# EAGLE design Sensor_Cameralink_TRX (EAGLE 9.6.2)
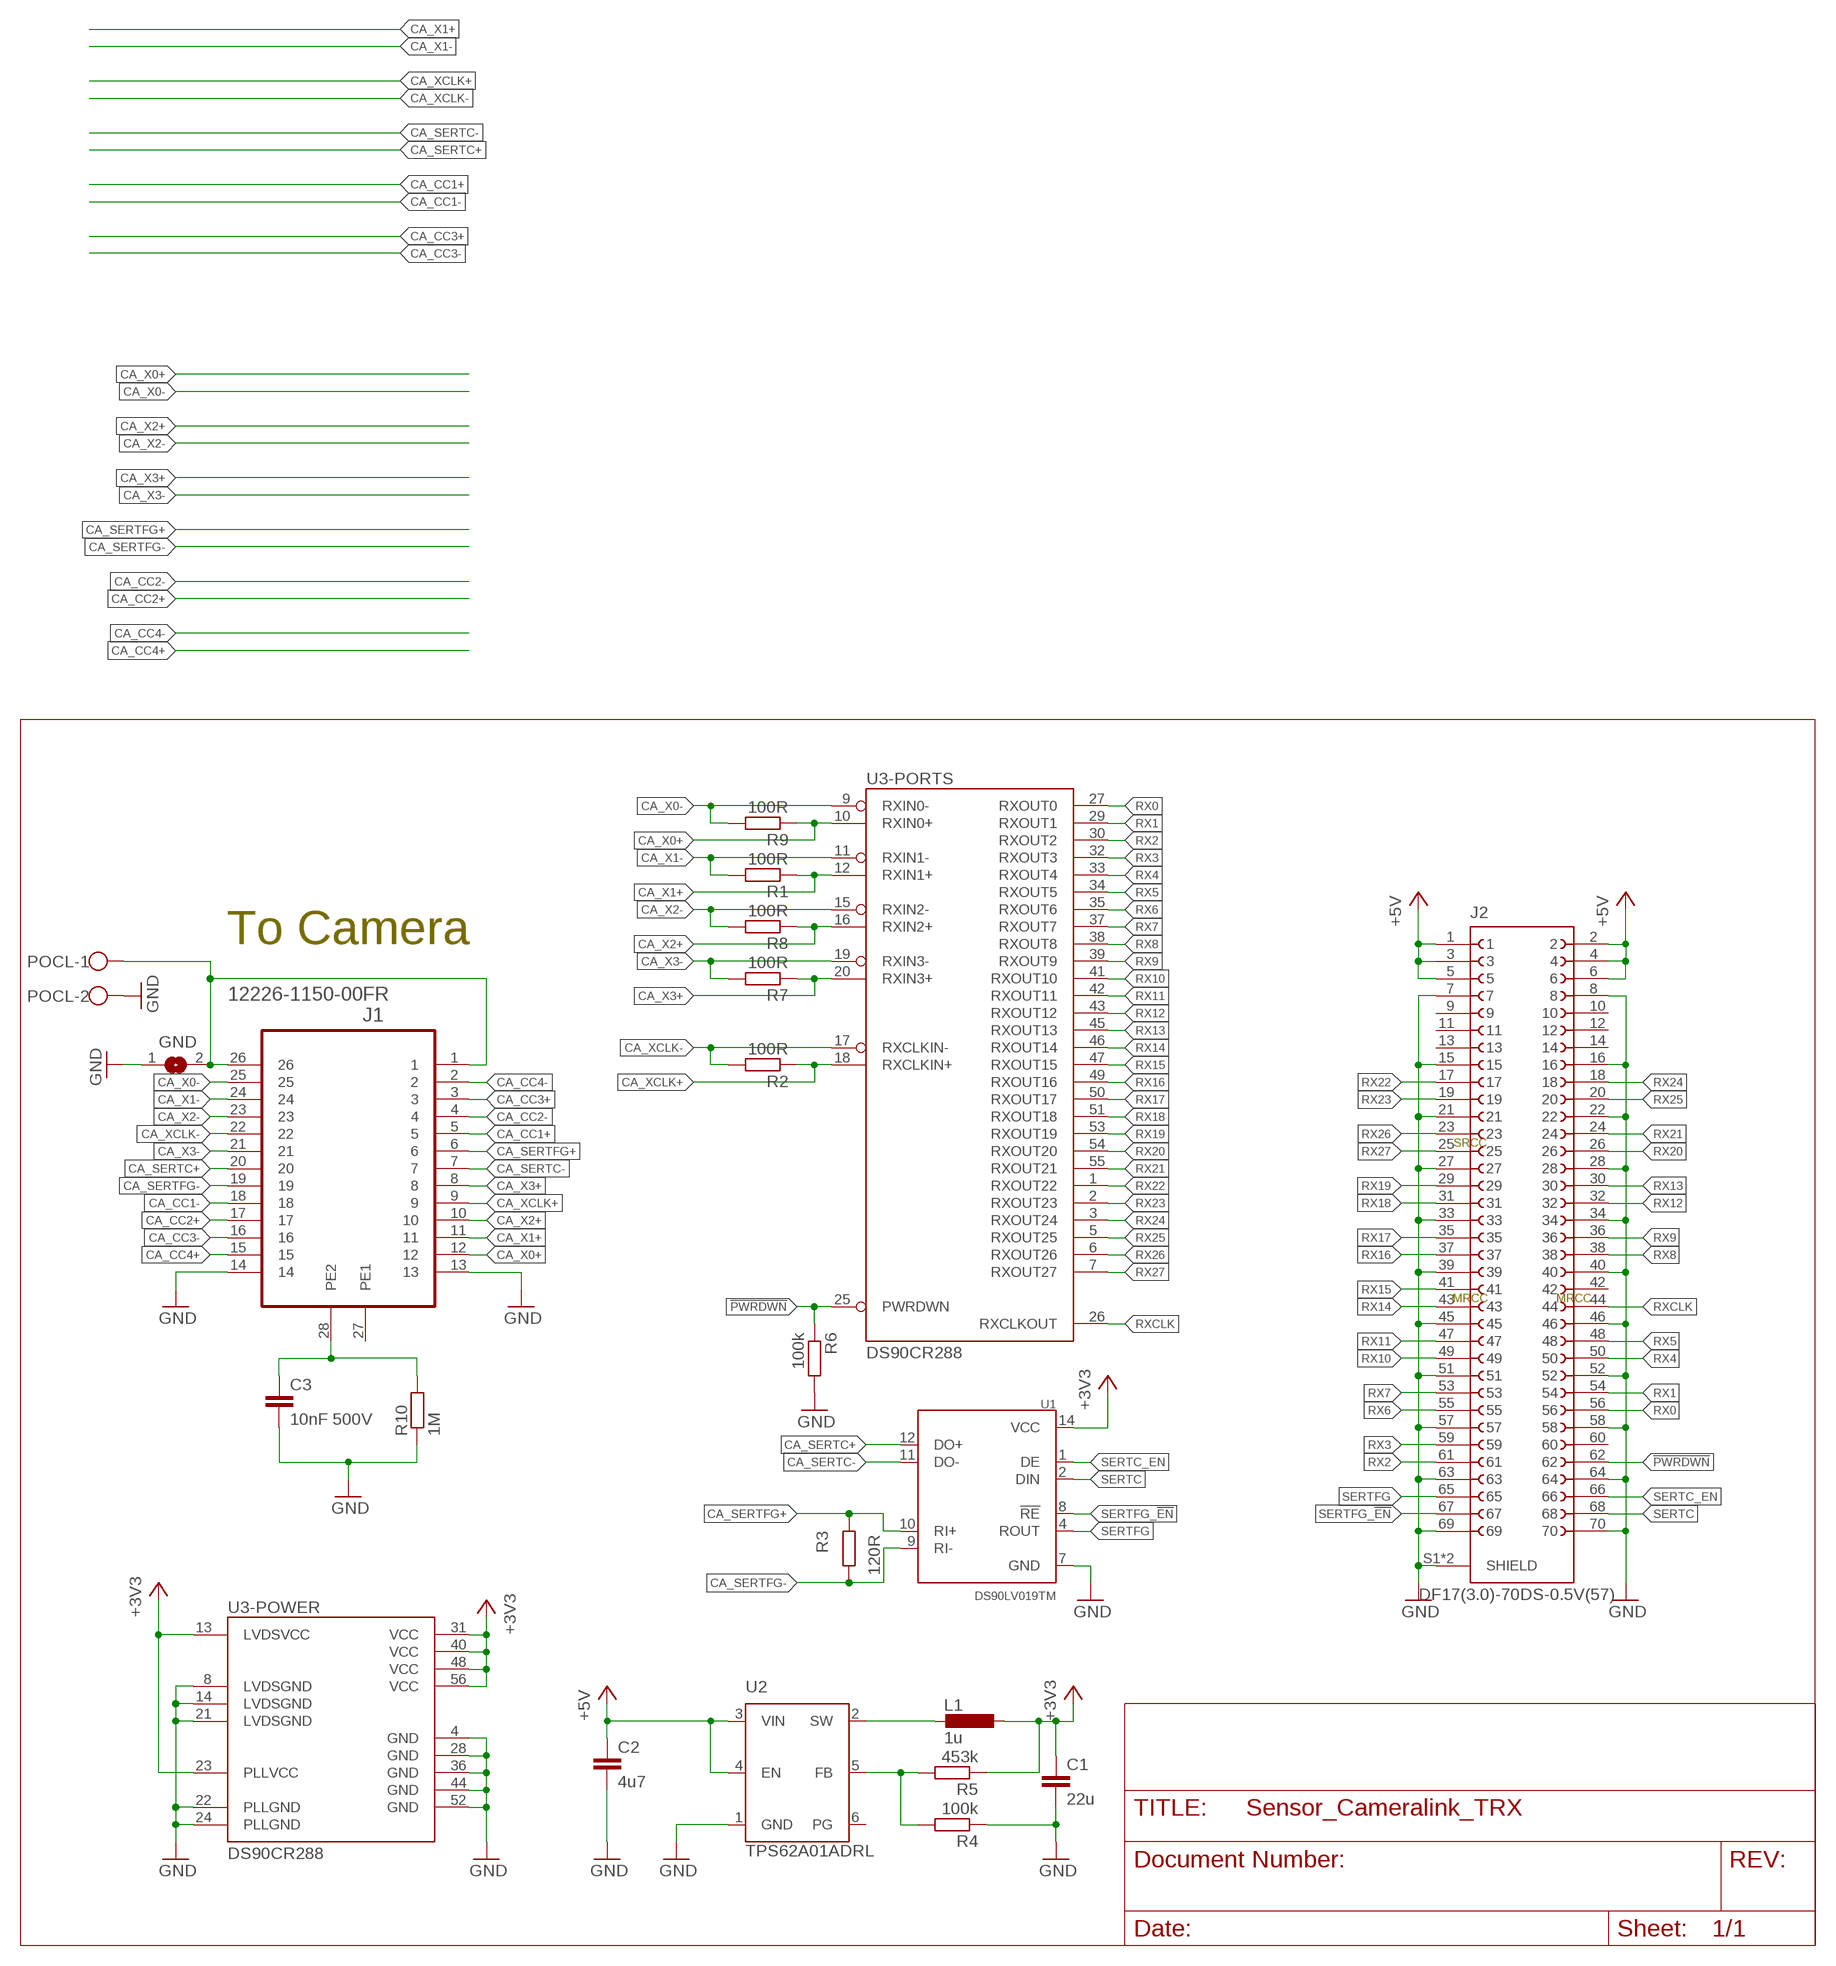
[diagram p0: schematic, sheet 1]

## Parts
C1  22u  C-EUC0603  [C0603]
C2  4u7  C-EUC0603  [C0603]
C3  10nF 500V  C-EUC0805  [C0805]
GND  SJ  [SJ]
J1  12226-1150-00FR  [3M_12226-1150-00FR]
J2  DF17(3.0)-70DS-0.5V(57)  [DF17(3.0)-70DS-0.5V(57)]
L1  1u  L-EU1008  [L1008]
POCL  W237-102  [W237-102]
R1  100R  R-EU_R0402  [R0402]
R2  100R  R-EU_R0402  [R0402]
R3  120R  R-EU_R0402  [R0402]
R4  100k  R-EU_R0402  [R0402]
R5  453k  R-EU_R0402  [R0402]
R6  100k  R-EU_R0402  [R0402]
R7  100R  R-EU_R0402  [R0402]
R8  100R  R-EU_R0402  [R0402]
R9  100R  R-EU_R0402  [R0402]
R10  1M  R-EU_R0805  [R0805]
U1  DS90LV019TM  [SO-14]
U2  TPS62A01ADRL  [SOTFL50P160X60-6N]
U3  DS90CR288  [HTSSOP56]

## Nets
!PWRDWN: J2.62 R6.1 U3.25(-PORTS:PWRDWN)
+3V3: C1.1 L1.1 R5.1 U1.14(VCC) U3.13(-POWER:LVDSVCC) U3.23(-POWER:PLLVCC) U3.31(-POWER:VCC) U3.40(-POWER:VCC) U3.48(-POWER:VCC) U3.56(-POWER:VCC)
+5V: C2.1 J2.1 J2.2 J2.3 J2.4 J2.5 J2.6 U2.3(VIN) U2.4(EN)
CA_CC1+: J1.5
CA_CC1-: J1.18
CA_CC2+: J1.17
CA_CC2-: J1.4
CA_CC3+: J1.3
CA_CC3-: J1.16
CA_CC4+: J1.15
CA_CC4-: J1.2
CA_SERTC+: J1.20 U1.12(DO+)
CA_SERTC-: J1.7 U1.11(DO-)
CA_SERTFG+: J1.6 R3.1 U1.10(RI+)
CA_SERTFG-: J1.19 R3.2 U1.9(RI-)
CA_X0+: J1.12 R9.1 U3.10(-PORTS:RXIN0+)
CA_X0-: J1.25 R9.2 U3.9(-PORTS:RXIN0-)
CA_X1+: J1.11 R1.1 U3.12(-PORTS:RXIN1+)
CA_X1-: J1.24 R1.2 U3.11(-PORTS:RXIN1-)
CA_X2+: J1.10 R8.1 U3.16(-PORTS:RXIN2+)
CA_X2-: J1.23 R8.2 U3.15(-PORTS:RXIN2-)
CA_X3+: J1.8 R7.1 U3.20(-PORTS:RXIN3+)
CA_X3-: J1.21 R7.2 U3.19(-PORTS:RXIN3-)
CA_XCLK+: J1.9 R2.1 U3.18(-PORTS:RXCLKIN+)
CA_XCLK-: J1.22 R2.2 U3.17(-PORTS:RXCLKIN-)
GND: C1.2 C2.2 C3.2 GND.1 J1.13 J1.14 J2.7 J2.8 J2.15 J2.16 J2.21 J2.22 J2.27 J2.28 J2.33 J2.34 J2.39 J2.40 J2.45 J2.46 J2.51 J2.52 J2.57 J2.58 J2.63 J2.64 J2.69 J2.70 J2.S1(SHIELD) J2.S2(SHIELD) POCL.2 R4.1 R6.2 R10.1 U1.7(GND) U2.1(GND) U3.4(-POWER:GND) U3.8(-POWER:LVDSGND) U3.14(-POWER:LVDSGND) U3.21(-POWER:LVDSGND) U3.22(-POWER:PLLGND) U3.24(-POWER:PLLGND) U3.28(-POWER:GND) U3.36(-POWER:GND) U3.44(-POWER:GND) U3.52(-POWER:GND)
N$00005: C3.1 J1.28(PE2) R10.2
N$00011: GND.2 J1.1 J1.26 POCL.1
N$00044: R4.2 R5.2 U2.5(FB)
N$50: L1.2 U2.2(SW)
RX0: J2.56 U3.27(-PORTS:RXOUT0)
RX1: J2.54 U3.29(-PORTS:RXOUT1)
RX2: J2.61 U3.30(-PORTS:RXOUT2)
RX3: J2.59 U3.32(-PORTS:RXOUT3)
RX4: J2.50 U3.33(-PORTS:RXOUT4)
RX5: J2.48 U3.34(-PORTS:RXOUT5)
RX6: J2.55 U3.35(-PORTS:RXOUT6)
RX7: J2.53 U3.37(-PORTS:RXOUT7)
RX8: J2.38 U3.38(-PORTS:RXOUT8)
RX9: J2.36 U3.39(-PORTS:RXOUT9)
RX10: J2.49 U3.41(-PORTS:RXOUT10)
RX11: J2.47 U3.42(-PORTS:RXOUT11)
RX12: J2.32 U3.43(-PORTS:RXOUT12)
RX13: J2.30 U3.45(-PORTS:RXOUT13)
RX14: J2.43 U3.46(-PORTS:RXOUT14)
RX15: J2.41 U3.47(-PORTS:RXOUT15)
RX16: J2.37 U3.49(-PORTS:RXOUT16)
RX17: J2.35 U3.50(-PORTS:RXOUT17)
RX18: J2.31 U3.51(-PORTS:RXOUT18)
RX19: J2.29 U3.53(-PORTS:RXOUT19)
RX20: J2.26 U3.54(-PORTS:RXOUT20)
RX21: J2.24 U3.55(-PORTS:RXOUT21)
RX22: J2.17 U3.1(-PORTS:RXOUT22)
RX23: J2.19 U3.2(-PORTS:RXOUT23)
RX24: J2.18 U3.3(-PORTS:RXOUT24)
RX25: J2.20 U3.5(-PORTS:RXOUT25)
RX26: J2.23 U3.6(-PORTS:RXOUT26)
RX27: J2.25 U3.7(-PORTS:RXOUT27)
RXCLK: J2.44 U3.26(-PORTS:RXCLKOUT)
SERTC: J2.68 U1.2(DIN)
SERTC_EN: J2.66 U1.1(DE)
SERTFG: J2.65 U1.4(ROUT)
SERTFG_!EN: J2.67 U1.8(!RE)
Unconnected: J1.27(PE1) J2.9 J2.10 J2.11 J2.12 J2.13 J2.14 J2.42 J2.60 U2.6(PG)

## Notes on the sheet
- To Camera
- SRCC
- MRCC | MRCC

## Library data of the parts
C1 = rcl:C-EU: CAPACITOR, European symbol; LCSC: C109448
C2 = rcl:C-EU: CAPACITOR, European symbol; LCSC: C19666
C3 = rcl:C-EU: CAPACITOR, European symbol; BUERKLIN: 56D510; LAGERORT: 67/01; MBM: 1; PREIS: 0,13
GND = jumper:SJ: SMD solder JUMPER
J1 = mh_fpga_anschlussplatine_v2:12226-1150-00FR: CONN SDR 26POS VERT RECEPT; FARNELL: 1321037; MBM: 1; PREIS: 10,08
J2 = Hirose:DF17(3.0)-70DS-0.5V(57)
L1 = rcl:L-EU: INDUCTOR, European symbol; DIGIKEY: 490-5112-1-ND; LCSC: C86091; MPN: LQM2HPN1R0MG0L
POCL = con-wago-500:W237-102: WAGO SCREW CLAMP; MPN: 237-102; OC_FARNELL: unknown; OC_NEWARK: 70K9898
R1 R2 R7-R9 = rcl:R-EU_: RESISTOR, European symbol; SPICEPREFIX: R
R3 = rcl:R-EU_: RESISTOR, European symbol; BUERKLIN: 07E508; MBM: 10; PREIS: 0,03; SPICEPREFIX: R
R4 R6 = rcl:R-EU_: RESISTOR, European symbol; DIGIKEY: RMCF0402FT100KCT-ND; LCSC: C60491; SPICEPREFIX: R
R5 = rcl:R-EU_: RESISTOR, European symbol; LCSC: C137978; SPICEPREFIX: R
R10 = resistor:R-EU_: RESISTOR, European symbol; BUERKLIN: 11E338; MBM: 10; PREIS: 0,04
U1 = texas:DS90LV019: DS90LV019 3.3V or 5V LVDS Driver/Receiver
U2 = TPS62A01DRLR:TPS62A01ADRL; DESCRIPTION: 2.5V-5.5V input, 1-A high efficiency step-down converter in 2x2 QFN or SOT563 package; DIGIKEY: 296-TPS62A01ADRLRCT-ND; HEIGHT: 0.6mm; LCSC: C5181455; MANUFACTURER_NAME: Texas Instruments; MANUFACTURER_PART_NUMBER: TPS62A01ADRLR; MOUSER: 595-TPS62A01ADRLR
U3 = lvds-2:DS90CR288

## Board
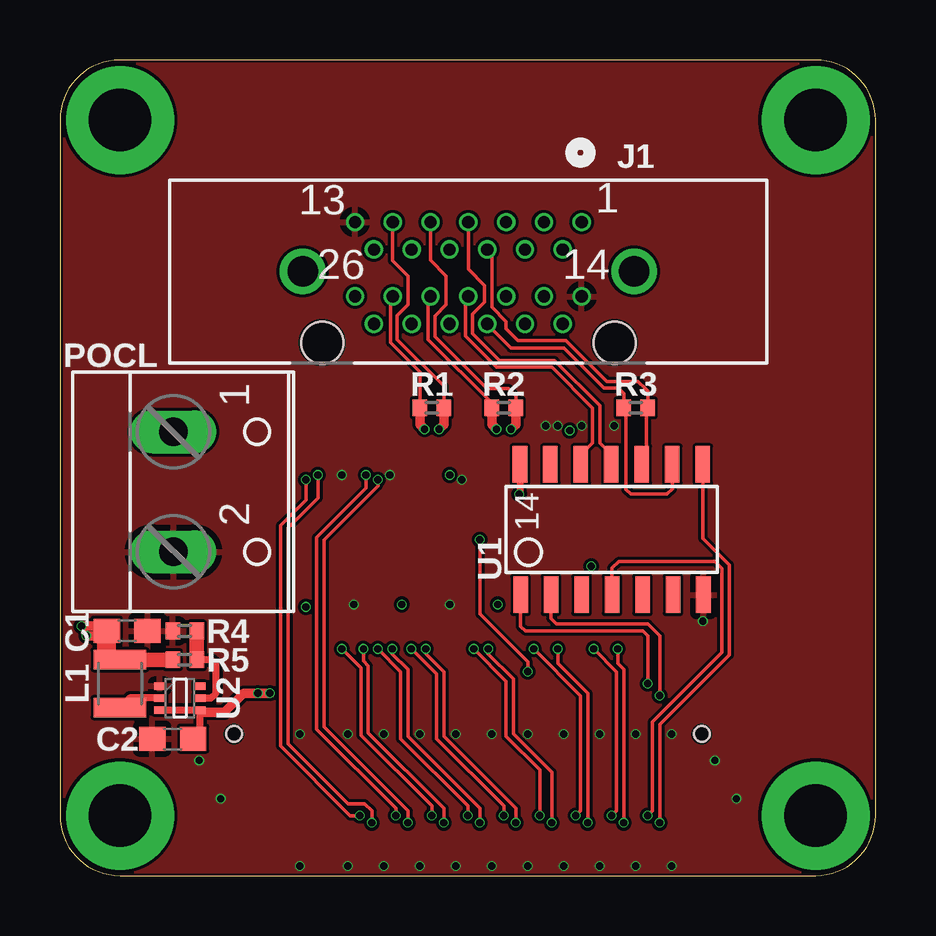
[diagram p1: board, top side]
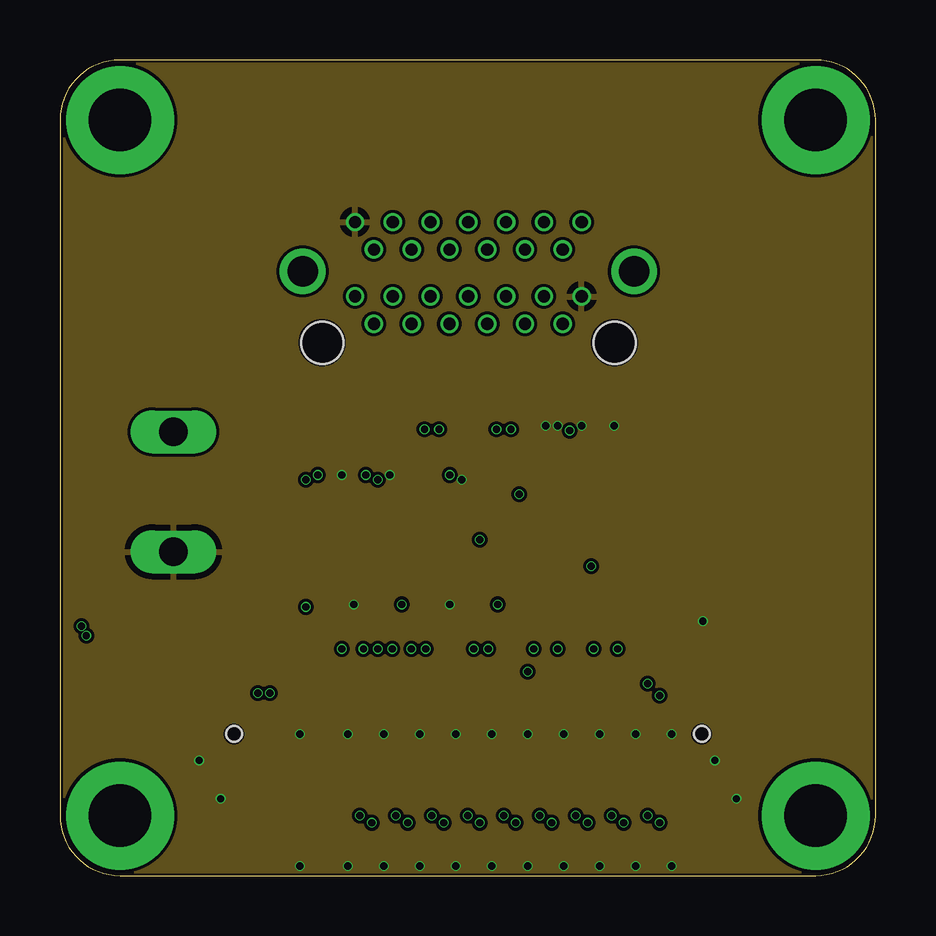
[diagram p2: board, inner layer Route2]
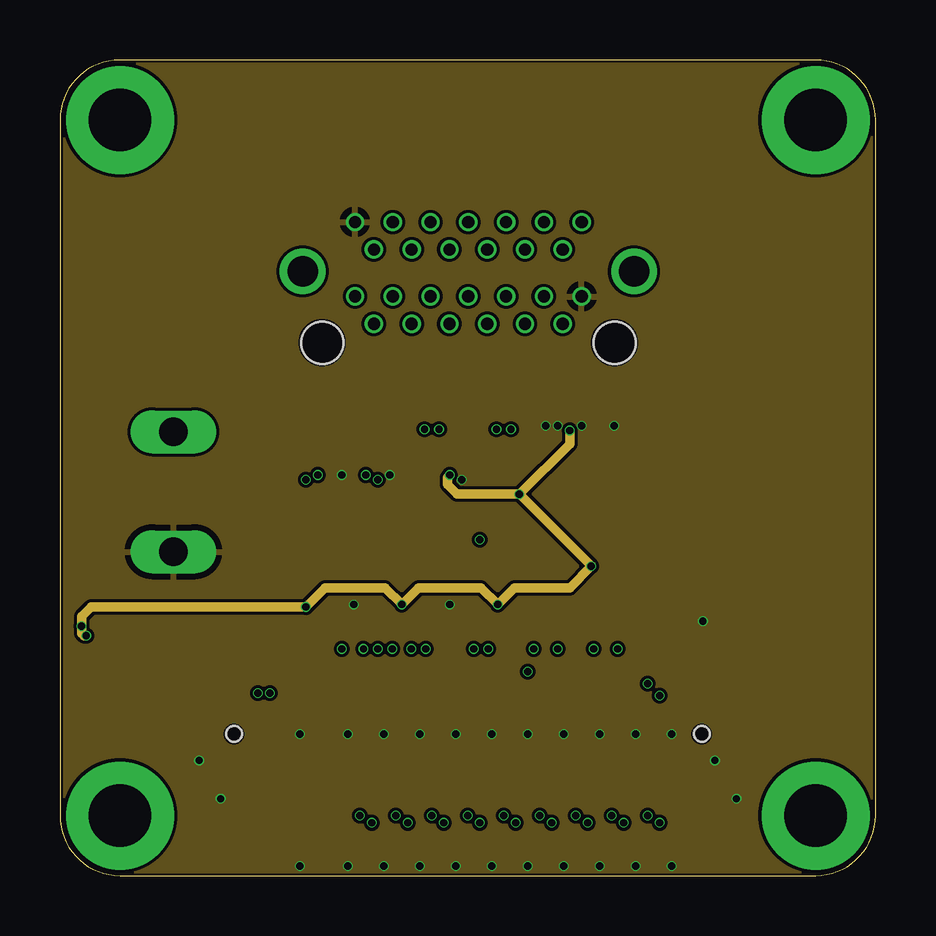
[diagram p3: board, inner layer Route15]
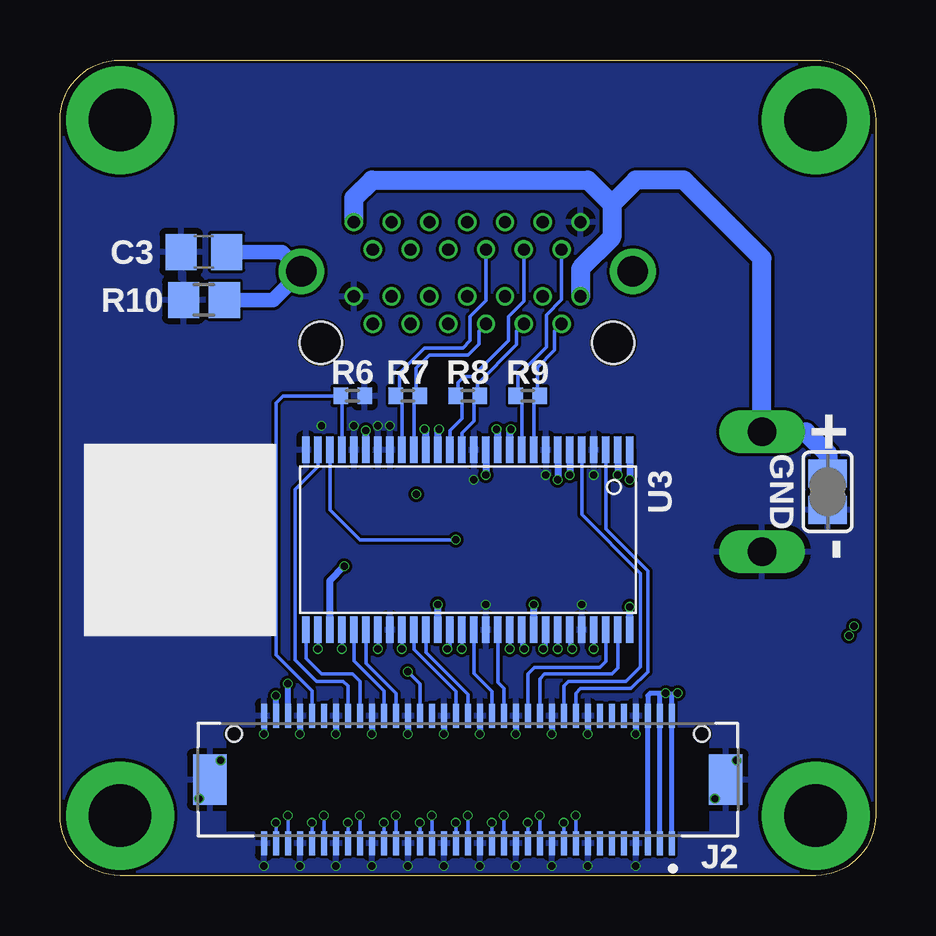
[diagram p4: board, bottom side, seen from below]

Size 34 x 34 mm. Coordinates in mm from the lower left corner, seen from the top.
Outline: 0,31.5 0,2.5 arc90 2.5,0 31.5,0 arc90 34,2.5 34,31.5 arc90 31.5,34 2.5,34 arc90 0,31.5
Copper layers (1*2*15*16): Top 0.035559375mm / dielectric 0.17018125mm / Route2 0.01778125mm / dielectric 47mil / Route15 0.01778125mm / dielectric 0.17018125mm / Bottom 0.035559375mm
Design rules "jlcpcb-4-layer *": minimum track width 5mil, minimum drill 0.2mm, track to track 5mil, track to pad 5mil, pad to pad 5mil, via to via 5mil, smd to smd 0mil, copper to edge 0.1mm, drill to drill 5mil, minimum pad ring 0.1mm, minimum via ring 0.05mm, stop-mask expansion 3mil, vias tented up to drill 100mil, thermal gap 10mil

### Footprints (pad centres in the part's own frame; a part is rotated, then mirrored left to right if it is on the bottom)
C0603 = smd 1.1 x 1: 1 -0.85,0; 2 0.85,0
C0805 = smd 1.3 x 1.5: 1 -0.95,0; 2 0.95,0
SJ = smd 1.168 x 1.6: 1 -0.762,0; 2 0.762,0
3M_12226-1150-00FR = drill 0.508: 1 9.449,4.242; 2 8.661,3.099; 3 7.874,4.242; 4 7.087,3.099; 5 6.299,4.242; 6 5.512,3.099; 7 4.724,4.242; 8 3.937,3.099; 9 3.15,4.242; 10 2.362,3.099; 11 1.575,4.242; 12 0.787,3.099; 13 0,4.242; 14 9.449,1.143; 15 8.661,0; 16 7.874,1.143; 17 7.087,0; 18 6.299,1.143; 19 5.512,0; 20 4.724,1.143; 21 3.937,0; 22 3.15,1.143; 23 2.362,0; 24 1.575,1.143; 25 0.787,0; 26 0,1.143 | drill 1.27: 27 -2.184,2.184; 28 11.633,2.184 | hole 1.753: -1.372,-0.787; 10.82,-0.787
DF17(3.0)-70DS-0.5V(57) = smd 0.25 x 1: 1 -8.5,2.65; 2 -8.5,-2.65; 3 -8,2.65; 4 -8,-2.65; 5 -7.5,2.65; 6 -7.5,-2.65; 7 -7,2.65; 8 -7,-2.65; 9 -6.5,2.65; 10 -6.5,-2.65; 11 -6,2.65; 12 -6,-2.65; 13 -5.5,2.65; 14 -5.5,-2.65; 15 -5,2.65; 16 -5,-2.65; 17 -4.5,2.65; 18 -4.5,-2.65; 19 -4,2.65; 20 -4,-2.65; 21 -3.5,2.65; 22 -3.5,-2.65; 23 -3,2.65; 24 -3,-2.65; 25 -2.5,2.65; 26 -2.5,-2.65; 27 -2,2.65; 28 -2,-2.65; 29 -1.5,2.65; 30 -1.5,-2.65; 31 -1,2.65; 32 -1,-2.65; 33 -0.5,2.65; 34 -0.5,-2.65; 35 0,2.65; 36 0,-2.65; 37 0.5,2.65; 38 0.5,-2.65; 39 1,2.65; 40 1,-2.65; 41 1.5,2.65; 42 1.5,-2.65; 43 2,2.65; 44 2,-2.65; 45 2.5,2.65; 46 2.5,-2.65; 47 3,2.65; 48 3,-2.65; 49 3.5,2.65; 50 3.5,-2.65; 51 4,2.65; 52 4,-2.65; 53 4.5,2.65; 54 4.5,-2.65; 55 5,2.65; 56 5,-2.65; 57 5.5,2.65; 58 5.5,-2.65; 59 6,2.65; 60 6,-2.65; 61 6.5,2.65; 62 6.5,-2.65; 63 7,2.65; 64 7,-2.65; 65 7.5,2.65; 66 7.5,-2.65; 67 8,2.65; 68 8,-2.65; 69 8.5,2.65; 70 8.5,-2.65 | smd 1.4 x 2.1: S1 -10.75,0; S2 10.75,0 | hole 0.65: -9.75,-1.9; 9.75,-1.9
L1008 = smd 0.8 x 2.2: 1 -1,0; 2 1,0
W237-102 = drill 1.194 long: 1 -2.5,-1.27; 2 2.5,-1.27
R0402 = smd 0.6 x 0.7: 1 -0.5,0; 2 0.5,0
R0805 = smd 1.3 x 1.5: 1 -0.85,0; 2 0.85,0
SO-14 = smd 0.61 x 1.524: 1 -3.795,-2.794; 2 -2.525,-2.794; 3 -1.255,-2.794; 4 0.015,-2.794; 5 1.285,-2.794; 6 2.555,-2.794; 7 3.825,-2.794; 8 3.795,2.644; 9 2.525,2.644; 10 1.255,2.644; 11 -0.015,2.644; 12 -1.285,2.644; 13 -2.555,2.644; 14 -3.825,2.644
SOTFL50P160X60-6N = smd 0.475 x 0.3: 1 -0.838,0.5; 2 -0.838,0; 3 -0.838,-0.5; 4 0.838,-0.5; 5 0.838,0; 6 0.838,0.5
HTSSOP56 = smd 0.3 x 1.1: 1 -6.75,-3.75; 2 -6.25,-3.75; 3 -5.75,-3.75; 4 -5.25,-3.75; 5 -4.75,-3.75; 6 -4.25,-3.75; 7 -3.75,-3.75; 8 -3.25,-3.75; 9 -2.75,-3.75; 10 -2.25,-3.75; 11 -1.75,-3.75; 12 -1.25,-3.75; 13 -0.75,-3.75; 14 -0.25,-3.75; 15 0.25,-3.75; 16 0.75,-3.75; 17 1.25,-3.75; 18 1.75,-3.75; 19 2.25,-3.75; 20 2.75,-3.75; 21 3.25,-3.75; 22 3.75,-3.75; 23 4.25,-3.75; 24 4.75,-3.75; 25 5.25,-3.75; 26 5.75,-3.75; 27 6.25,-3.75; 28 6.75,-3.75; 29 6.75,3.75; 30 6.25,3.75; 31 5.75,3.75; 32 5.25,3.75; 33 4.75,3.75; 34 4.25,3.75; 35 3.75,3.75; 36 3.25,3.75; 37 2.75,3.75; 38 2.25,3.75; 39 1.75,3.75; 40 1.25,3.75; 41 0.75,3.75; 42 0.25,3.75; 43 -0.25,3.75; 44 -0.75,3.75; 45 -1.25,3.75; 46 -1.75,3.75; 47 -2.25,3.75; 48 -2.75,3.75; 49 -3.25,3.75; 50 -3.75,3.75; 51 -4.25,3.75; 52 -4.75,3.75; 53 -5.25,3.75; 54 -5.75,3.75; 55 -6.25,3.75; 56 -6.75,3.75

### Placement (x,y rotation side)
C1  2.8,10.2 0 top
C2  4.7,5.7 180 top
C3  28,26 180 bottom
GND  2,16 90 bottom
J1  12.3,23 0 top
J2  17,4 180 bottom
L1  2.5,8 270 top
POCL  6,16 270 top
R1  15.5,19.5 180 top
R2  18.5,19.5 180 top
R3  24,19.5 180 top
R4  5.2,10.2 0 top
R5  5.2,9 0 top
R6  21.8,20 0 bottom
R7  19.5,20 0 bottom
R8  17,20 0 bottom
R9  14.5,20 0 bottom
R10  28,24 0 bottom
U1  23,14.5 0 top
U2  5,7.4 0 top
U3  17,14 180 bottom

### Tracks (layer width: path | path; a pad name or v marks a point on that pad's centre or on a via)
!PWRDWN
  Bottom 0.15: U3.25 22.25,19.95 R6.1 24.7,20 25,19.7 25,9.2 23.5,7.7 J2.62
+3V3  (via drill 0.3)
  Top 0.3: U1.14 19.18,15.93 v19.15,15.9
  Top 0.4: v0.9,10.4 1.75,10.4 C1.1 1.75,10 v1.1,10
  Top 0.6: R5.1 L1.1 2.2,9 1.95,9.25
  Top 0.8: 1.95,9.25 C1.1
  Route15 0.4: v21.25,18.55 21.25,18 v19.15,15.9 | v19.15,15.9 16.55,15.9 16.15,16.3 16.15,16.6 v16.25,16.7 | v1.1,10 1,10 0.9,10.1 v0.9,10.4 0.9,10.8 1.3,11.2 v10.25,11.2 11.05,12 13.55,12 v14.25,11.3 14.95,12 17.55,12 v18.25,11.3 18.95,12 21.25,12 v22.15,12.9 v19.15,15.9
  Bottom 0.3: U3.31 22.75,12.3 v22.15,12.9 | U3.40 v18.25,11.3 | U3.48 v14.25,11.3 | U3.56 v10.25,11.2 | U3.13 v16.25,16.7 | U3.23 v21.25,18.55
+5V  (via drill 0.3)
  Top 0.3: U2.3 U2.4 5.84,6.8 5.84,5.99 C2.1
  Top 0.4: v8.75,7.6 v8.25,7.6 7.65,7.6 6.85,6.8 5.84,6.8
  Bottom 0.2: J2.1 J2.2 8.5,7.5 | J2.3 J2.4 9,7.6 | J2.5 J2.6 9.5,7.5 9.4,7.6 9,7.6 | 8.5,7.5 8.6,7.6 v8.75,7.6 9,7.6 | 8.5,7.5 8.4,7.6 v8.25,7.6
CA_SERTC+
  Top 0.15: J1.20 16.9,24.02 16.9,22.5 18.2,21.2 20.5,21.2 22.2,19.5 22.2,18.03 21.71,17.54 U1.12
CA_SERTC-
  Top 0.15: J1.7 17.02,25.28 17.7,24.6 17.7,23.9 17.2,23.4 17.2,22.59 18.32,21.48 20.62,21.48 22.5,19.6 22.5,18.03 22.98,17.54 U1.11
CA_SERTFG+
  Top 0.15: J1.6 18,25.91 18,23.7 18.6,23.1 18.6,22.8 19.1,22.3 21.1,22.3 22.7,20.7 | U1.10 24.45,17.34 24.45,19.45 R3.1 24.5,20.2 24.4,20.3
  Top 0.152: 22.7,20.7 22.8,20.6 24.1,20.6 24.4,20.3
CA_SERTFG-
  Top 0.15: J1.19 18.81,22 21,22 | U1.9 25.52,16.12 25.3,15.9 23.8,15.9 23.6,16.1 23.6,19.4 R3.2 23.5,20.1
  Top 0.152: 23.5,20.1 23.28,20.32 22.68,20.32 21,22
CA_X0+
  Bottom 0.15: J1.12 13.09,24.01 13.73,23.37 13.73,22.02 14.9,20.85 14.9,20.1 R9.1 14.75,19.75 U3.10
CA_X0-
  Bottom 0.15: J1.25 13.39,22.7 13.39,21.9 14.1,21.19 14.1,20.1 R9.2 14.25,19.75 U3.9
CA_X1+  (via drill 0.3)
  Top 0.15: J1.11 13.88,25.62 14.5,25 14.5,23.8 14.05,23.35 14.05,22.35 16,20.4 R1.1
  Top 0.4: v15.8,18.6 16,18.8 R1.1
  Bottom 0.3: U3.12 15.75,18.55 v15.8,18.6
CA_X1-  (via drill 0.3)
  Top 0.15: J1.24 13.78,24.04 13.78,22.23 15,21 R1.2
  Top 0.4: v15.2,18.6 15,18.8 R1.2
  Bottom 0.3: U3.11 15.25,18.55 v15.2,18.6
CA_X2+
  Bottom 0.15: U3.16 17.75,18.55 17.25,19.05 17.25,19.75 R8.1 17.4,20.1 17.4,20.55 17.15,20.8 16.79,20.8 15.3,22.29 15.3,23.3 14.66,23.94 J1.10
CA_X2-
  Bottom 0.15: U3.15 17.25,18.45 16.75,18.95 16.75,19.75 R8.2 16.6,20.1 16.6,20.5 14.96,22.14 14.96,22.7 J1.23
CA_X3+
  Bottom 0.15: J1.8 16.24,23.96 16.9,23.3 16.9,22.3 17.2,22 18.8,22 19.85,20.95 19.85,20.15 R7.1 19.75,19.75 U3.20
CA_X3-
  Bottom 0.15: J1.21 16.54,22.7 16.54,22.16 17,21.7 18.6,21.7 19.15,21.15 19.15,20.15 R7.2 19.25,19.75 U3.19
CA_XCLK+  (via drill 0.3)
  Top 0.15: J1.9 15.45,25.65 16.1,25 16.1,23.8 15.63,23.33 15.63,22.46 17.79,20.3 18.7,20.3 19,20 R2.1
  Top 0.4: v18.8,18.6 19,18.8 R2.1
  Bottom 0.3: U3.18 18.75,18.55 v18.8,18.6
CA_XCLK-  (via drill 0.3)
  Top 0.15: J1.22 15.35,24.04 15.35,22.35 18,19.7 R2.2
  Top 0.4: v18.2,18.6 18,18.8 R2.2
  Bottom 0.3: U3.17 18.25,18.55 v18.2,18.6
GND  (via drill 0.3)
  Bottom 0.25: J2.40 v18,5.9 | J2.46 v19.5,5.9 | J2.52 v21,5.9 | J2.58 v22.5,5.9 | J2.28 v15,5.9 | J2.34 v16.5,5.9 | J2.22 v13.5,5.9 | 24,6.28 J2.64 v24,5.9 | J2.70 v25.5,5.9 | 10,6.28 J2.8 v10,5.9 | J2.16 v12,5.9
  other vias: 15,0.4 16.5,0.4 18,0.4 19.5,0.4 21,0.4 22.5,0.4 24,0.4 5.8,4.8 6.7,3.2 27.3,4.8 28.2,3.2 13.5,0.4 12,0.4 10,0.4 25.5,0.4 26.8,10.6 16.25,11.3 12.25,11.3 11.75,16.7 13.75,16.7 16.75,16.5 20.25,18.75 20.75,18.75 21.75,18.75 23.1,18.75
  pour Top: 0,0 34,0 34,34 0,34
  pour Bottom: 0,0 34,0 34,34 0,34
  pour Route15: 0,0 34,0 34,34 0,34
  pour Route2: 0,0 34,0 34,34 0,34
N$00005
  Bottom 0.6: C3.1 24.75,26 J1.28 25.12,24 R10.2
N$00011
  Bottom 0.8: GND.2 2,17.6 2.9,18.5 POCL.1 4.73,25.73 8,29 10,29 11,28 | J1.1 21.75,28.25 21,29 12,29 11,28 | 11,28 11,26.6 12.3,25.3 J1.26
N$00025  (via drill 2.6 pad 4.5)
  other vias: 2.5,31.5
N$00026  (via drill 2.6 pad 4.5)
  other vias: 31.5,31.5
N$00027  (via drill 2.6 pad 4.5)
  other vias: 2.5,2.5
N$00028  (via drill 2.6 pad 4.5)
  other vias: 31.5,2.5
N$00044
  Top 0.3: U2.5 6.3,7.4 6.5,7.6 6.5,8.8 6.3,9 R5.2
  Top 0.6: R5.2 R4.2
N$50
  Top 0.3: U2.2 2.9,7.4 L1.2
RX0
  Bottom 0.15: U3.27 23.25,17.05 24.2,16.1 24.2,9 23.3,8.1 22.2,8.1 22,7.9 J2.56
RX1
  Bottom 0.15: U3.29 23.75,9.05 23.1,8.4 21.8,8.4 21.5,8.1 J2.54
RX2  (via drill 0.3)
  Top 0.15: v23.25,9.45 23.25,8.85 23.5,8.6 v23.5,2.2
  Bottom 0.15: U3.30 v23.25,9.45 | v23.5,2.2 J2.61
RX3  (via drill 0.3)
  Top 0.15: v22.25,9.45 23.2,8.5 23.2,2.7 v23,2.5
  Bottom 0.15: U3.32 v22.25,9.45 | v23,2.5 J2.59
RX4
  Bottom 0.15: U3.33 21.75,8.95 20.5,7.7 J2.50
RX5
  Bottom 0.15: U3.34 21.25,8.84 20,7.59 J2.48
RX6  (via drill 0.3)
  Top 0.15: v20.75,9.45 20.75,8.85 22,7.6 v22,2.2
  Bottom 0.15: U3.35 v20.75,9.45 | v22,2.2 J2.55
RX7  (via drill 0.3)
  Top 0.15: v19.75,9.45 21.7,7.5 21.7,2.7 v21.5,2.5
  Bottom 0.15: U3.37 v19.75,9.45 | v21.5,2.5 J2.53
RX8
  Bottom 0.15: U3.38 19.25,9.42 17.5,7.67 J2.38
RX9
  Bottom 0.15: U3.39 18.75,9.31 17,7.56 J2.36
RX10  (via drill 0.3)
  Top 0.15: v17.85,9.45 17.85,9.25 18.9,8.2 18.9,5.9 20.5,4.3 v20.5,2.2
  Bottom 0.15: U3.41 17.75,9.55 v17.85,9.45 | v20.5,2.2 J2.49
RX11  (via drill 0.3)
  Top 0.15: v17.25,9.45 18.6,8.1 18.6,5.8 20,4.4 v20,2.5
  Bottom 0.15: U3.42 v17.25,9.45 | v20,2.5 J2.47
RX12
  Bottom 0.15: U3.43 16.75,8.42 16,7.67 J2.32
RX13
  Bottom 0.15: U3.45 15.75,8.05 15.5,7.8 J2.30
RX14  (via drill 0.3)
  Top 0.15: v15.25,9.45 15.25,9.25 16,8.5 16,5.8 19,2.8 v19,2.2
  Bottom 0.15: U3.46 v15.25,9.45 | v19,2.2 J2.43
RX15  (via drill 0.3)
  Top 0.15: v14.65,9.45 15.7,8.4 15.7,5.7 18.5,2.9 v18.5,2.5
  Bottom 0.15: U3.47 14.75,9.55 v14.65,9.45 | v18.5,2.5 J2.41
RX16  (via drill 0.3)
  Top 0.15: v13.85,9.45 13.85,9.25 14.5,8.6 14.5,5.8 17.5,2.8 v17.5,2.2
  Bottom 0.15: U3.49 13.75,9.55 v13.85,9.45 | v17.5,2.2 J2.37
RX17  (via drill 0.3)
  Top 0.15: v13.25,9.45 14.2,8.5 14.2,5.7 17,2.9 v17,2.5
  Bottom 0.15: U3.50 v13.25,9.45 | v17,2.5 J2.35
RX18  (via drill 0.3)
  Top 0.15: v12.65,9.45 12.65,8.95 12.85,8.75 12.85,5.95 16,2.8 v16,2.2
  Bottom 0.15: U3.51 12.75,9.55 v12.65,9.45 | v16,2.2 J2.31
RX19  (via drill 0.3)
  Top 0.15: v11.75,9.45 12.55,8.65 12.55,5.85 15.5,2.9 v15.5,2.5
  Bottom 0.15: U3.53 v11.75,9.45 | v15.5,2.5 J2.29
RX20
  Bottom 0.15: U3.54 11.25,8.93 11.5,8.68 14.22,8.68 14.5,8.4 J2.26
RX21
  Bottom 0.15: U3.55 10.75,8.65 11,8.4 13.8,8.4 14,8.2 J2.24
RX22  (via drill 0.3)
  Top 0.15: v12.5,2.5 12.1,2.5 9.2,5.4 9.2,14.6 10.25,15.65 v10.25,16.5
  Bottom 0.15: J2.17 v12.5,2.5
  Bottom 0.3: U3.1 v10.25,16.5
RX23  (via drill 0.3)
  Top 0.15: v13,2.2 13,2.7 12.7,3 12,3 9.5,5.5 9.5,14.5 10.75,15.75 v10.75,16.7
  Bottom 0.15: J2.19 v13,2.2
  Bottom 0.3: U3.2 v10.75,16.7
RX24
  Bottom 0.15: U3.3 11.25,14.45 9.5,12.7 9.5,8.5 10.2,7.8 12.3,7.8 12.5,7.6 J2.18
RX25
  Bottom 0.15: U3.5 12.25,15.05 9.8,12.6 9.8,8.7 10.4,8.1 12.8,8.1 13,7.9 J2.20
RX26  (via drill 0.3)
  Top 0.15: v14,2.5 14,2.8 10.7,6.1 10.7,14.1 12.75,16.15 v12.75,16.7
  Bottom 0.15: J2.23 v14,2.5
  Bottom 0.3: U3.6 v12.75,16.7
RX27  (via drill 0.3)
  Top 0.15: v14.5,2.2 14.5,2.7 11,6.2 11,14 13.25,16.25 v13.25,16.5
  Bottom 0.15: J2.25 v14.5,2.2
  Bottom 0.3: U3.7 v13.25,16.5
RXCLK  (via drill 0.3)
  Top 0.15: v17.5,14 17.5,10.9 19.5,8.9 v19.5,8.5
  Bottom 0.15: U3.26 22.75,15.25 21.5,14 v17.5,14 | J2.44 19,8 v19.5,8.5
SERTC  (via drill 0.3)
  Top 0.15: U1.2 20.48,10.72 20.7,10.5 24.5,10.5 25,10 v25,7.5
  Bottom 0.25: J2.68 v25,7.5
SERTC_EN  (via drill 0.3)
  Top 0.15: U1.1 19.2,10.39 19.4,10.2 24.3,10.2 24.5,10 v24.5,8
  Bottom 0.25: J2.66 v24.5,8
SERTFG  (via drill 0.3)
  Top 0.15: U1.4 23.02,12.82 23.3,13.1 27.3,13.1 27.6,12.8 27.6,9.3 24.7,6.4 24.7,2.7 v24.5,2.5
  Bottom 0.15: v24.5,2.5 J2.65
SERTFG_!EN  (via drill 0.3)
  Top 0.15: U1.8 26.8,14.04 27.9,12.94 27.9,9.2 25,6.3 v25,2.2
  Bottom 0.15: v25,2.2 J2.67

### Text on the board
bNames: + | -
tStop: CAMERALINK